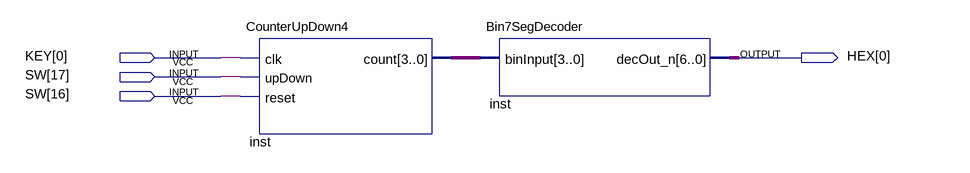
[diagram p0: schematic sheet]
// Quartus schematic Counter_Demo.bdf as structural Verilog: 2 symbols, 4 pins
module Counter_Demo (
  input  [0:0] KEY,
  input  [17:16] SW,
  output [0:0] HEX
);

  wire [3:0] inst_count;
  wire [6:0] inst_decout_n;

  CounterUpDown4 inst (.clk(KEY[0]), .upDown(SW[17]), .reset(SW[16]), .count(inst_count));
  Bin7SegDecoder inst_dup2 (.binInput(inst_count), .decOut_n(inst_decout_n));
endmodule
